# EAGLE schematic main (EAGLE 6.1)
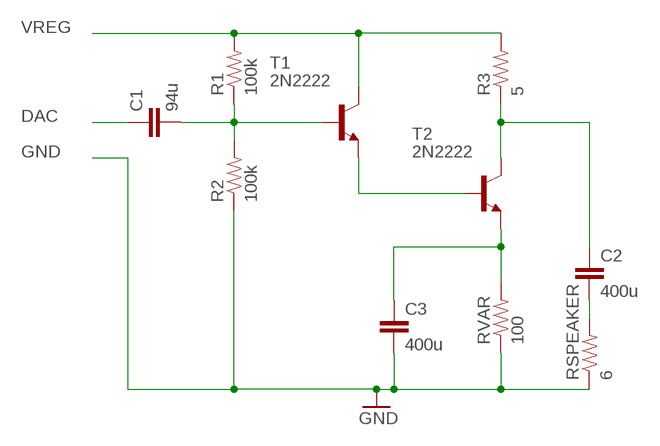
[diagram p0: schematic, sheet 1]

## Parts
C1  94u  CAPKIT  [CAP-PTH-SMALL-KIT]
C2  400u  CAPKIT  [CAP-PTH-SMALL-KIT]
C3  400u  CAPKIT  [CAP-PTH-SMALL-KIT]
R1  100k  RESISTORPTH-1/4W  [AXIAL-0.4]
R2  100k  RESISTORPTH-1/4W  [AXIAL-0.4]
R3  5  RESISTORPTH-1/4W  [AXIAL-0.4]
RSPEAKER  6  RESISTORPTH-1/4W  [AXIAL-0.4]
RVAR  100  RESISTORPTH-1/4W  [AXIAL-0.4]
T1  2N2222  [TO18]
T2  2N2222  [TO18]

## Nets
DAC: C1.1
GND: C3.2 R2.P$1 RSPEAKER.P$1 RVAR.P$1
N$1: C2.1 R3.P$1 T2.3(C)
N$3: C1.2 R1.P$1 R2.P$2 T1.2(B)
N$5: T1.1(E) T2.2(B)
N$7: C3.1 RVAR.P$2 T2.1(E)
VOUT: C2.2 RSPEAKER.P$2
VREG: R1.P$2 R3.P$2 T1.3(C)

## Library data of the parts
C1-C3 = SparkFun:CAP: Capacitor Standard 0603 ceramic capacitor, and 0.1" leaded capacitor.
R1-R3 RSPEAKER RVAR = SparkFun:RESISTOR: Resistor Basic schematic elements and footprints for 0603, 1206, and PTH resistors.
T1 T2 = transistor:2N2222: NPN TRANSISTOR